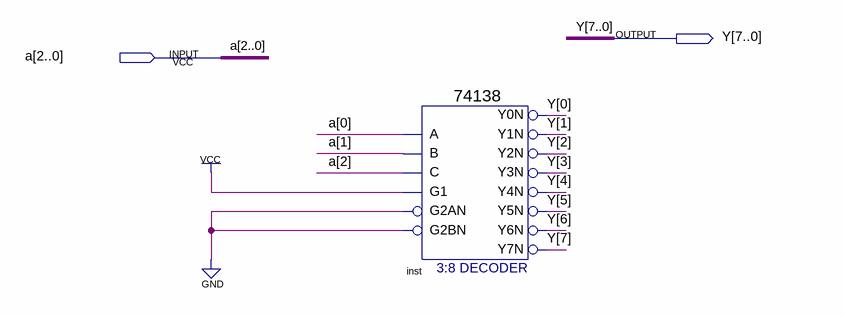
[diagram p0: schematic sheet]
// Quartus schematic three_eight_transfer.bdf as structural Verilog: 1 symbols, 2 pins
module three_eight_transfer (
  input  [2:0] a,
  output [7:0] Y
);

  \74138  inst (
    .A(a[0]), .B(a[1]), .G1(1'b1), .C(a[2]), .G2AN(1'b0), .G2BN(1'b0), .Y0N(Y[0]), .Y1N(Y[1]), .Y2N(Y[2]),
    .Y3N(Y[3]), .Y4N(Y[4]), .Y5N(Y[5]), .Y6N(Y[6]), .Y7N(Y[7]));
endmodule
